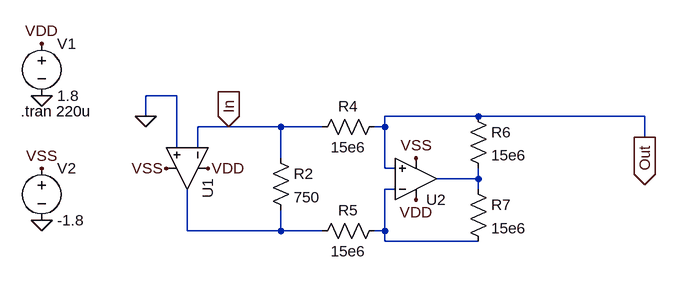
[diagram p0: schematic I_controlled_I_source.asc]
I_controlled_I_source.asc, the LTspice schematic file:
Version 4
SHEET 1 2152 1172
WIRE 800 304 752 304
WIRE 752 336 752 304
WIRE 1264 336 1120 336
WIRE 1520 336 1264 336
WIRE 880 352 832 352
WIRE 960 352 880 352
WIRE 1024 352 960 352
WIRE 1120 352 1120 336
WIRE 1120 352 1104 352
WIRE 1520 368 1520 336
WIRE 800 384 800 304
WIRE 832 384 832 352
WIRE 960 400 960 352
WIRE 1120 416 1120 352
WIRE 1136 416 1120 416
WIRE 1264 432 1264 416
WIRE 1264 432 1200 432
WIRE 1136 448 1120 448
WIRE 1264 448 1264 432
WIRE 816 512 816 448
WIRE 960 512 960 480
WIRE 960 512 816 512
WIRE 1024 512 960 512
WIRE 1120 512 1120 448
WIRE 1120 512 1104 512
WIRE 1120 528 1120 512
WIRE 1264 528 1120 528
FLAG 592 304 0
FLAG 592 224 VDD
FLAG 592 496 0
FLAG 592 416 VSS
FLAG 752 336 0
FLAG 848 416 VDD
FLAG 784 416 VSS
FLAG 1168 400 VSS
FLAG 1168 464 VDD
FLAG 880 352 In
IOPIN 880 352 In
FLAG 1520 368 Out
IOPIN 1520 368 Out
SYMBOL voltage 592 208 R0
WINDOW 123 0 0 Left 0
WINDOW 39 0 0 Left 0
SYMATTR InstName V1
SYMATTR Value 1.8
SYMBOL voltage 592 400 R0
WINDOW 123 0 0 Left 0
WINDOW 39 0 0 Left 0
SYMATTR InstName V2
SYMATTR Value -1.8
SYMBOL res 944 384 R0
SYMATTR InstName R2
SYMATTR Value 750
SYMBOL OpAmps\\UniversalOpAmp 816 416 R90
SYMATTR InstName U1
SYMBOL OpAmps\\UniversalOpAmp 1168 432 M180
SYMATTR InstName U2
SYMBOL res 1120 336 R90
WINDOW 0 0 56 VBottom 2
WINDOW 3 32 56 VTop 2
SYMATTR InstName R4
SYMATTR Value 15e6
SYMBOL res 1120 496 R90
WINDOW 0 0 56 VBottom 2
WINDOW 3 32 56 VTop 2
SYMATTR InstName R5
SYMATTR Value 15e6
SYMBOL res 1248 320 R0
SYMATTR InstName R6
SYMATTR Value 15e6
SYMBOL res 1248 432 R0
SYMATTR InstName R7
SYMATTR Value 15e6
TEXT 560 328 Left 2 !.tran 220u

The netlist it stands for:
* I_controlled_I_source.asc
V1 VDD 0 1.8
V2 VSS 0 -1.8
R2 In N003 750
XU1 0 In VDD VSS N003 level1 Avol=1Meg GBW=10Meg Vos=0 En=0 Enk=0 In=0 Ink=0 Rin=500Meg  ; pins In+ In- V+ V- OUT
XU2 Out N002 VDD VSS N001 level1 Avol=1Meg GBW=10Meg Vos=0 En=0 Enk=0 In=0 Ink=0 Rin=500Meg  ; pins In+ In- V+ V- OUT
R4 Out In 15e6
R5 N002 N003 15e6
R6 Out N001 15e6
R7 N001 N002 15e6
.tran 220u
.lib UniversalOpAmp1.lib
.backanno
.end